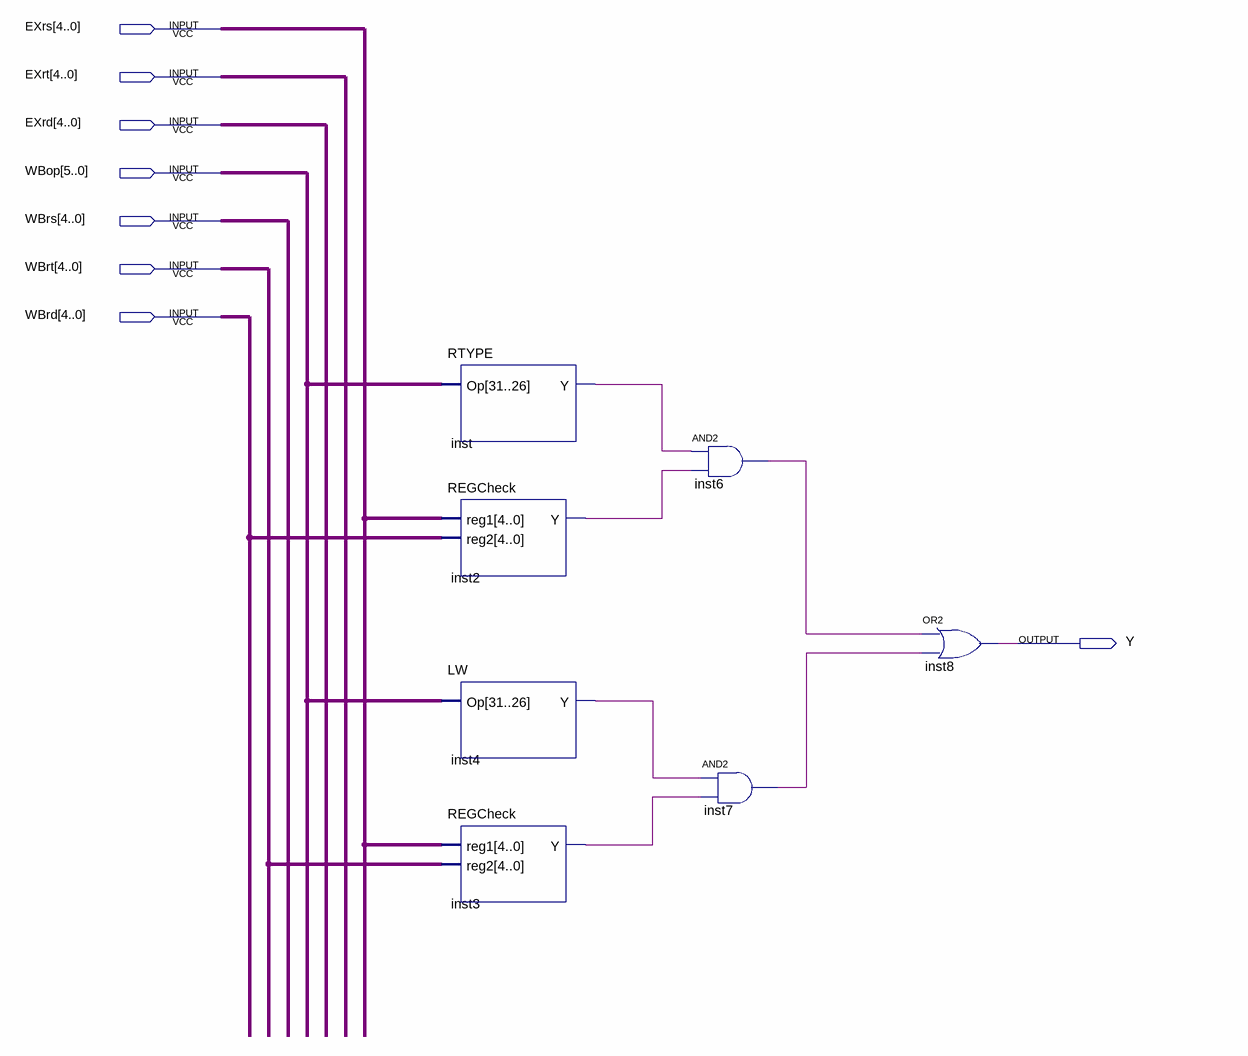
[diagram p0: schematic sheet]
// Quartus schematic ForwardAfromWBtoEX.bdf as structural Verilog: 7 symbols, 8 pins
module ForwardAfromWBtoEX (
  input  [4:0] EXrs,
  input  [4:0] EXrt,
  input  [4:0] EXrd,
  input  [5:0] WBop,
  input  [4:0] WBrs,
  input  [4:0] WBrt,
  input  [4:0] WBrd,
  output Y
);

  wire inst2_y, inst3_y, inst4_y, inst6_out, inst7_out, inst_y;

  RTYPE inst (.Op(WBop), .Y(inst_y));
  REGCheck inst2 (.reg1(EXrs), .reg2(WBrd), .Y(inst2_y));
  LW inst4 (.Op(WBop), .Y(inst4_y));
  REGCheck inst3 (.reg1(EXrs), .reg2(WBrt), .Y(inst3_y));
  and inst6 (inst6_out, inst_y, inst2_y);
  and inst7 (inst7_out, inst4_y, inst3_y);
  or inst8 (Y, inst6_out, inst7_out);
endmodule
